# EAGLE design screenSlave (EAGLE 9.0.1)
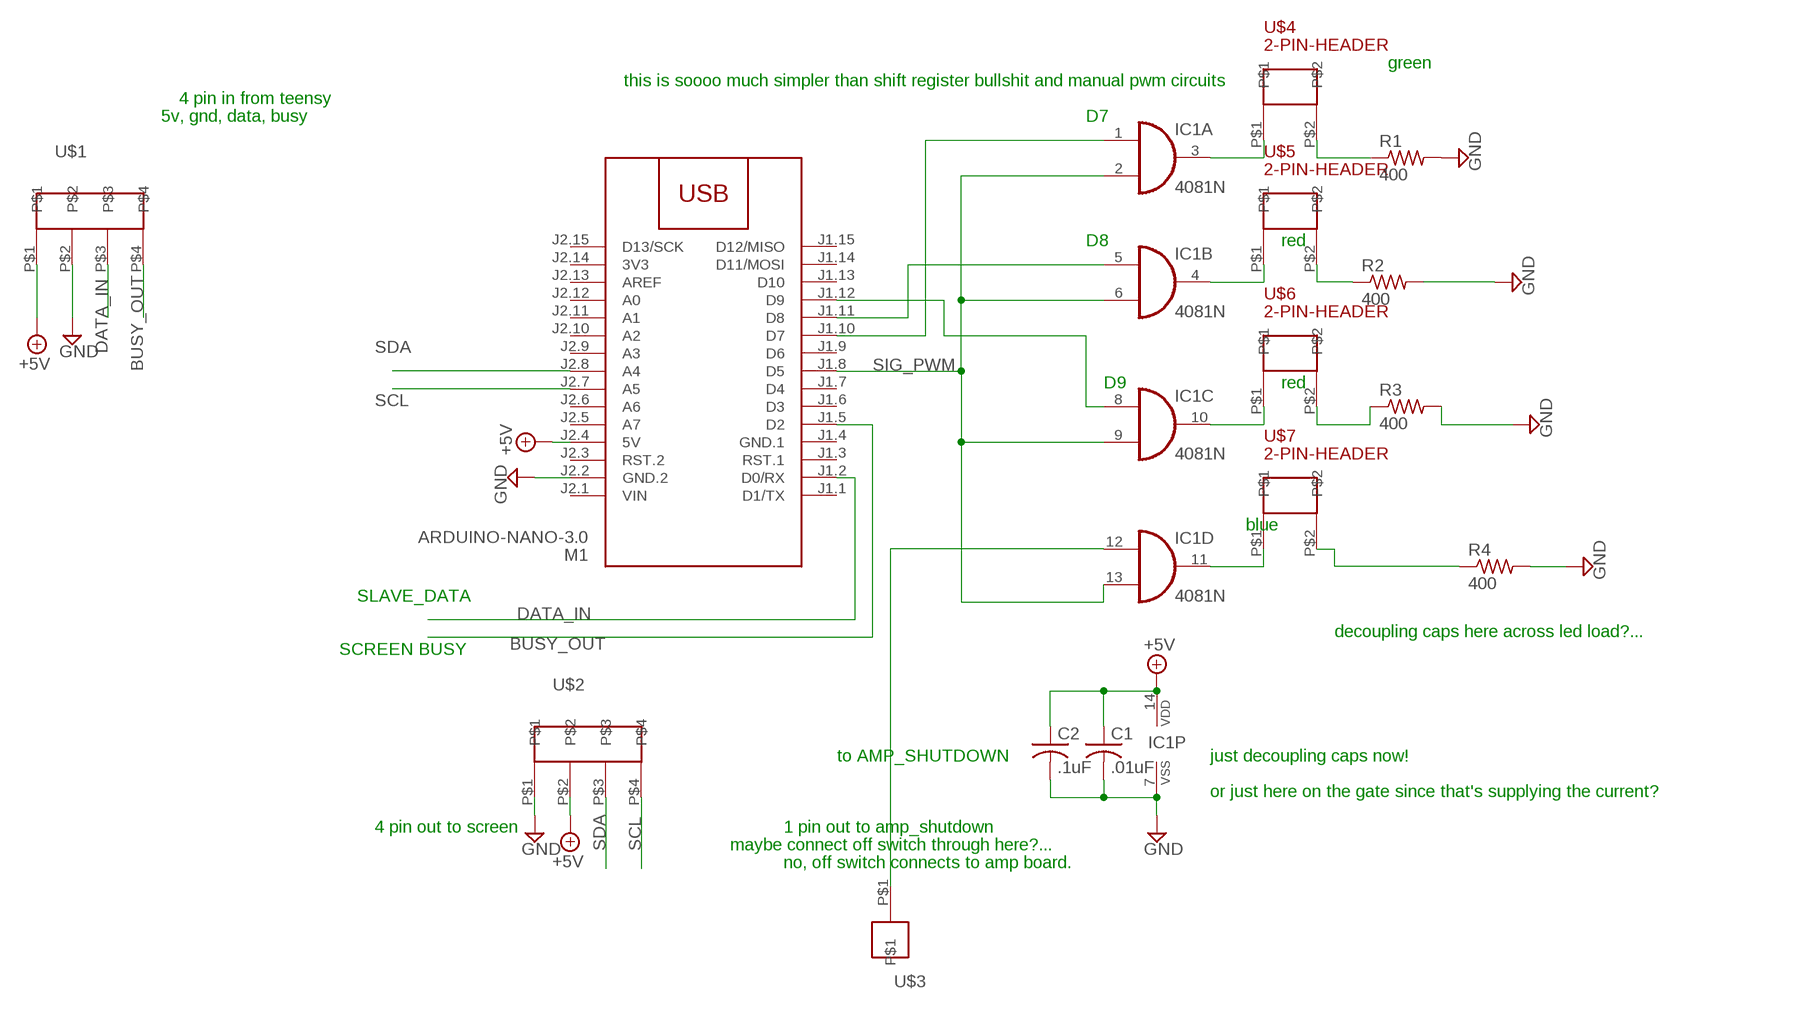
[diagram p0: schematic, sheet 1]

## Parts
C1  .01uF  C-US025-024X044  [C025-024X044]
C2  .1uF  C-US025-024X044  [C025-024X044]
IC1  4081N  [DIL14]
M1  ARDUINO-NANO-3.0  [ARDUINO-NANO-3.0]
R1  400  R-US_0204/7  [0204/7]
R2  400  R-US_0204/7  [0204/7]
R3  400  R-US_0204/7  [0204/7]
R4  400  R-US_0204/7  [0204/7]
U$1  4-PIN-HEADER  [4-PIN-HEADER]
U$2  4-PIN-HEADER  [4-PIN-HEADER]
U$3  1-PIN-HEADER  [1-PIN-HEADER]
U$4  2-PIN-HEADER  [2-PIN-HEADER]
U$5  2-PIN-HEADER  [2-PIN-HEADER]
U$6  2-PIN-HEADER  [2-PIN-HEADER]
U$7  2-PIN-HEADER  [2-PIN-HEADER]

## Nets
+5V: C1.1 C2.1 IC1.14(P:VDD) M1.J2.4(5V) U$1.P$1 U$2.P$2
BUSY_OUT: M1.J1.5(D2) U$1.P$4
DATA_IN: M1.J1.2(D0/RX) U$1.P$3
GND: C1.2 C2.2 IC1.7(P:VSS) M1.J2.2(GND.2) R1.2 R2.2 R3.2 R4.2 U$1.P$2 U$2.P$1
N$1: IC1.12(D:I0) U$3.P$1
N$2: IC1.11(D:O) U$7.P$1
N$4: IC1.3(A:O) U$4.P$1
N$5: R1.1 U$4.P$2
N$6: IC1.4(B:O) U$5.P$1
N$7: IC1.10(C:O) U$6.P$1
N$8: R3.1 U$6.P$2
N$9: IC1.1(A:I0) M1.J1.10(D7)
N$10: R2.1 U$5.P$2
N$11: IC1.5(B:I0) M1.J1.11(D8)
N$12: IC1.8(C:I0) M1.J1.12(D9)
N$14: R4.1 U$7.P$2
SCL: M1.J2.7(A5) U$2.P$4
SDA: M1.J2.8(A4) U$2.P$3
SIG_PWM: IC1.2(A:I1) IC1.6(B:I1) IC1.9(C:I1) IC1.13(D:I1) M1.J1.8(D5)
Unconnected: M1.J1.1(D1/TX) M1.J1.3(RST.1) M1.J1.6(D3) M1.J1.7(D4) M1.J1.9(D6) M1.J1.13(D10) M1.J1.14(D11/MOSI) M1.J1.15(D12/MISO) M1.J2.3(RST.2) M1.J2.5(A7) M1.J2.6(A6) M1.J2.9(A3) M1.J2.10(A2) M1.J2.11(A1) M1.J2.12(A0) M1.J2.13(AREF) M1.J2.15(D13/SCK)

## Notes on the sheet
- green
- this is soooo much simpler than shift register bullshit and manual pwm circuits
- 4 pin in from teensy
- 5v, gnd, data, busy | D7
- D8 | red
- D9 | red
- blue
- SLAVE_DATA
- decoupling caps here across led load?...
- SCREEN BUSY
- to AMP_SHUTDOWN | just decoupling caps now!
- or just here on the gate since that's supplying the current?
- 4 pin out to screen | 1 pin out to amp_shutdown
- maybe connect off switch through here?...
- no, off switch connects to amp board.

## Power pins joined to a net without a drawn wire
3V3: M1.J2.14(3V3)
GND.1: M1.J1.4(GND.1)
VIN: M1.J2.1(VIN)

## Library data of the parts
C1 C2 = rcl:C-US: CAPACITOR, American symbol; SPICEPREFIX: C
IC1 = 40xx:4081: Quad 2-input AND
M1 = diy-modules:ARDUINO-NANO-3.0: Arduino Nano 3.0 and compatible devices More details available here: https://www.arduino.cc/en/Main/ArduinoBoardNano Click here to find device on ebay.com <http://www.ebay.com/sch/arduino+nano>
R1-R4 = rcl:R-US_: RESISTOR, American symbol; SPICEPREFIX: R
U$1 U$2 = mask_lbr:4-PIN-HEADER
U$3 = mask_lbr:1-PIN-HEADER
U$4-U$7 = mask_lbr:2-PIN-HEADER

## Net classes
0 default: width 0.508 mm, clearance 0.254 mm

## Board
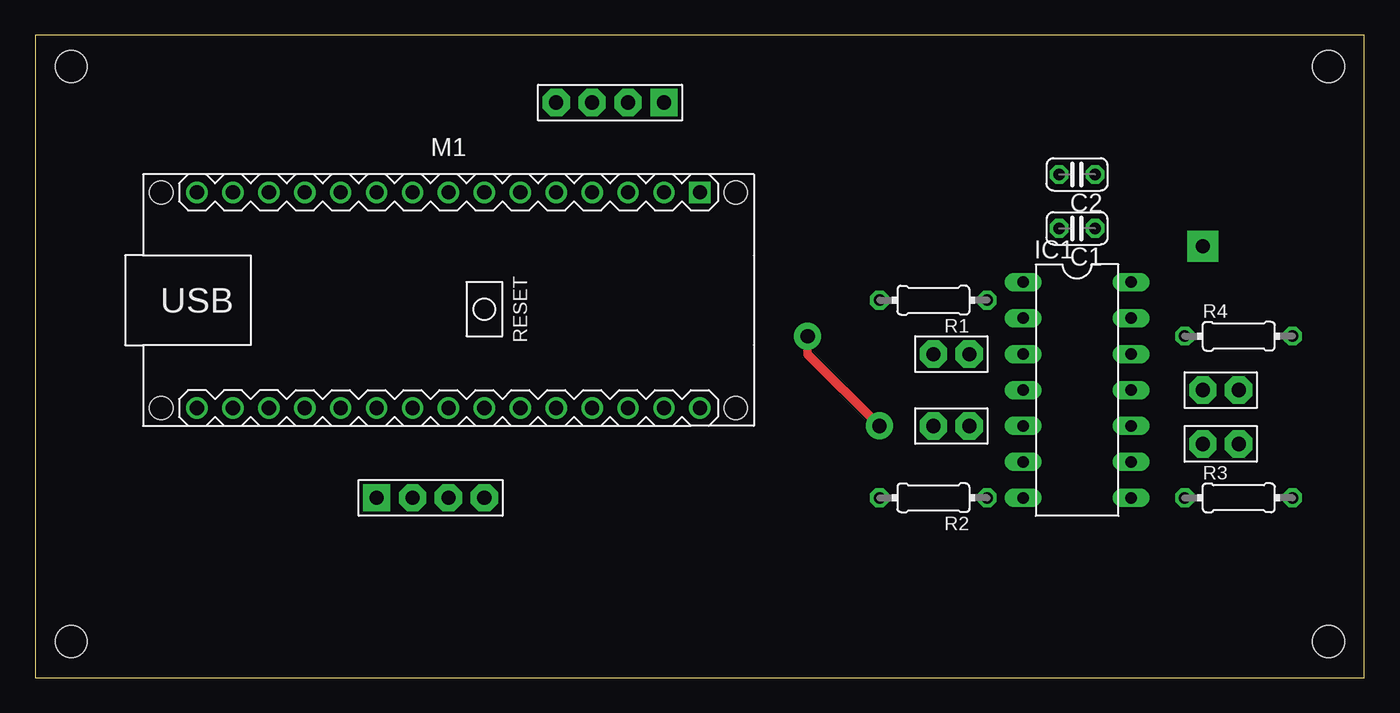
[diagram p1: board, top side]
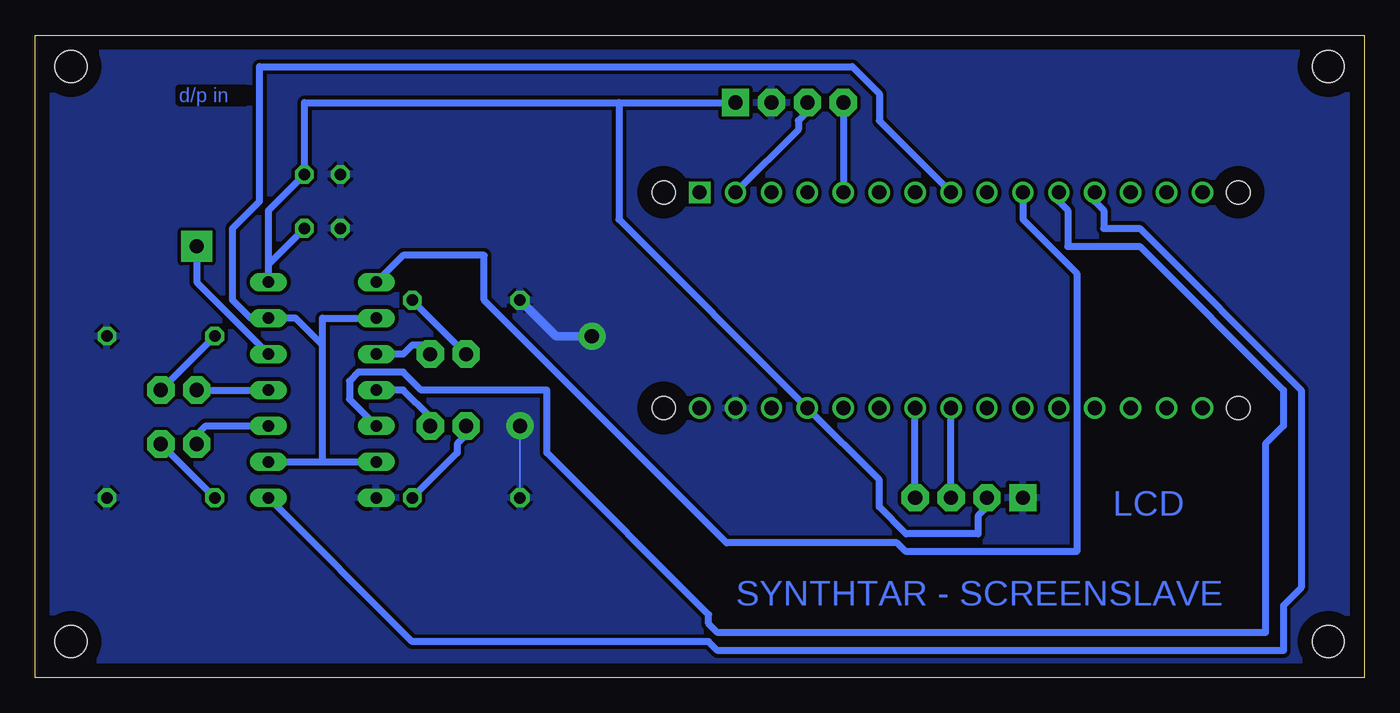
[diagram p2: board, bottom side, seen from below]

Size 93.96 x 45.39 mm. Coordinates in mm from the lower left corner, seen from the top.
Outline: 0,0 93.96,0 93.96,45.39 0,45.39 0,0
Copper layers (1*16): Top 0.035mm / dielectric 1.5mm / Bottom 0.035mm
Design rules "default": minimum track width 6mil, minimum drill 0.35mm, track to track 6mil, track to pad 6mil, pad to pad 6mil, via to via 6mil, smd to smd 6mil, copper to edge 40mil, drill to drill 6mil, minimum pad ring 10mil, minimum via ring 8mil, stop-mask expansion 4mil, vias tented up to drill 0mil, thermal gap 10mil
Holes 2.26 mm at 2.54,43.18 91.44,43.18 91.44,2.54 2.54,2.54

### Footprints (pad centres in the part's own frame; a part is rotated, then mirrored left to right if it is on the bottom)
C025-024X044 = drill 0.813 octagon: 1 -1.27,0; 2 1.27,0
DIL14 = drill 0.813 long: 1 -7.62,-3.81; 2 -5.08,-3.81; 3 -2.54,-3.81; 4 0,-3.81; 5 2.54,-3.81; 6 5.08,-3.81; 7 7.62,-3.81; 8 7.62,3.81; 9 5.08,3.81; 10 2.54,3.81; 11 0,3.81; 12 -2.54,3.81; 13 -5.08,3.81; 14 -7.62,3.81
ARDUINO-NANO-3.0 = drill 1 square: J1.1 17.78,7.62 | drill 1: J1.2 15.24,7.62; J1.3 12.7,7.62; J1.4 10.16,7.62; J1.5 7.62,7.62; J1.6 5.08,7.62; J1.7 2.54,7.62; J1.8 0,7.62; J1.9 -2.54,7.62; J1.10 -5.08,7.62; J1.11 -7.62,7.62; J1.12 -10.16,7.62; J1.13 -12.7,7.62; J1.14 -15.24,7.62; J1.15 -17.78,7.62; J2.1 17.78,-7.62; J2.2 15.24,-7.62; J2.3 12.7,-7.62; J2.4 10.16,-7.62; J2.5 7.62,-7.62; J2.6 5.08,-7.62; J2.7 2.54,-7.62; J2.8 0,-7.62; J2.9 -2.54,-7.62; J2.10 -5.08,-7.62; J2.11 -7.62,-7.62; J2.12 -10.16,-7.62; J2.13 -12.7,-7.62; J2.14 -15.24,-7.62; J2.15 -17.78,-7.62 | hole 1.651: -20.32,7.62; -20.32,-7.62; 20.32,-7.62; 20.32,7.62
0204/7 = drill 0.813 octagon: 1 -3.81,0; 2 3.81,0
4-PIN-HEADER = drill 1 pad 1.93 square: P$1 -3.81,0 | drill 1 pad 1.93 octagon: P$2 -1.27,0; P$3 1.27,0; P$4 3.81,0
1-PIN-HEADER = drill 1 pad 2.184 square: P$1 0,0
2-PIN-HEADER = drill 1 pad 1.93 octagon: P$1 -1.27,0; P$2 1.27,0

### Placement (x,y rotation side)
C1  73.66,31.75 180 top
C2  73.66,35.56 180 top
IC1  73.66,20.32 270 top
M1  29.21,26.67 0 top
R1  63.5,26.67 180 top
R2  63.5,12.7 180 top
R3  85.09,12.7 0 top
R4  85.09,24.13 0 top
U$1  40.64,40.64 180 top
U$2  27.94,12.7 0 top
U$3  82.55,30.48 90 top
U$4  64.77,22.86 180 top
U$5  64.77,17.78 180 top
U$6  83.82,16.51 0 top
U$7  83.82,20.32 0 top

### Tracks (layer width: path | path; a pad name or v marks a point on that pad's centre or on a via)
+5V
  Bottom 0.508: U$2.P$2 26.67,12.07 27.3,11.43 27.3,10.16 32.38,10.16 34.29,12.07 34.29,13.97 M1.J2.4 52.7,32.39 52.7,40.64 | 77.47,29.21 C1.1 | IC1.14 77.47,29.21 | 77.47,29.21 77.47,33.02 C2.1 74.93,40.64 52.7,40.64 | 52.7,40.64 U$1.P$1
BUSY_OUT
  Bottom 0.508: U$1.P$4 M1.J1.5
DATA_IN
  Bottom 0.508: M1.J1.2 40.01,38.73 40.01,39.37 39.37,40 U$1.P$3
GND  (via drill 1 pad 1.91)
  Top 0.61: v59.69,17.78 54.61,22.86 v54.61,24.13
  Bottom 0.152: R2.2 v59.69,17.78
  Bottom 0.61: v54.61,24.13 57.15,24.13 R1.2
  pour Bottom: 0,67.31 93.98,67.31 93.98,0 0,0
N$1
  Bottom 0.508: IC1.12 82.55,27.94 U$3.P$1
N$2
  Bottom 0.508: U$7.P$1 IC1.11
N$4
  Bottom 0.508: IC1.3 67.94,22.86 67.31,23.5 66.04,23.5 U$4.P$1
N$5
  Bottom 0.508: U$4.P$2 R1.1
N$6
  Bottom 0.508: IC1.4 67.94,20.32 66.04,18.41 U$5.P$1
N$7
  Bottom 0.508: IC1.10 81.92,17.78 82.55,17.14 U$6.P$1
N$8
  Bottom 0.508: U$6.P$2 R3.1
N$9
  Bottom 0.508: IC1.1 67.94,29.85 62.23,29.85 62.23,26.67 45.09,9.52 33.02,9.52 32.38,8.89 20.32,8.89 20.32,28.57 24.13,32.39 M1.J1.10
N$10
  Bottom 0.508: R2.1 64.14,15.88 64.14,16.51 63.5,17.14 U$5.P$2
N$11
  Bottom 0.508: IC1.5 71.75,19.68 71.75,20.95 71.12,21.59 67.94,21.59 66.67,20.32 57.78,20.32 57.78,15.88 46.35,4.45 46.35,3.81 45.72,3.18 6.99,3.18 6.99,16.51 5.71,17.78 5.71,20.32 15.88,30.48 20.95,30.48 20.95,33.02 21.59,33.66 M1.J1.11
N$12
  Bottom 0.508: IC1.8 67.31,2.54 46.35,2.54 45.72,1.9 5.71,1.9 5.71,5.08 4.45,6.35 4.45,20.32 15.88,31.75 18.41,31.75 18.41,33.02 19.05,33.66 M1.J1.12
N$14
  Bottom 0.508: U$7.P$2 R4.1
SCL
  Bottom 0.508: U$2.P$4 M1.J2.7
SDA
  Bottom 0.508: U$2.P$3 M1.J2.8
SIG_PWM
  Bottom 0.508: IC1.9 73.66,15.24 | 73.66,15.24 IC1.6 | IC1.2 73.66,25.4 73.66,23.5 | 73.66,15.24 73.66,23.5 | 73.66,23.5 75.56,25.4 IC1.13 78.74,25.4 80.01,26.67 80.01,31.75 78.11,33.66 78.11,43.18 36.2,43.18 34.29,41.28 34.29,39.37 M1.J1.8

### Text on the board
Bottom: d/p in | LCD | SYNTHTAR - SCREENSLAVE